# Altium schematic sheet MCU.SchDoc
size A4
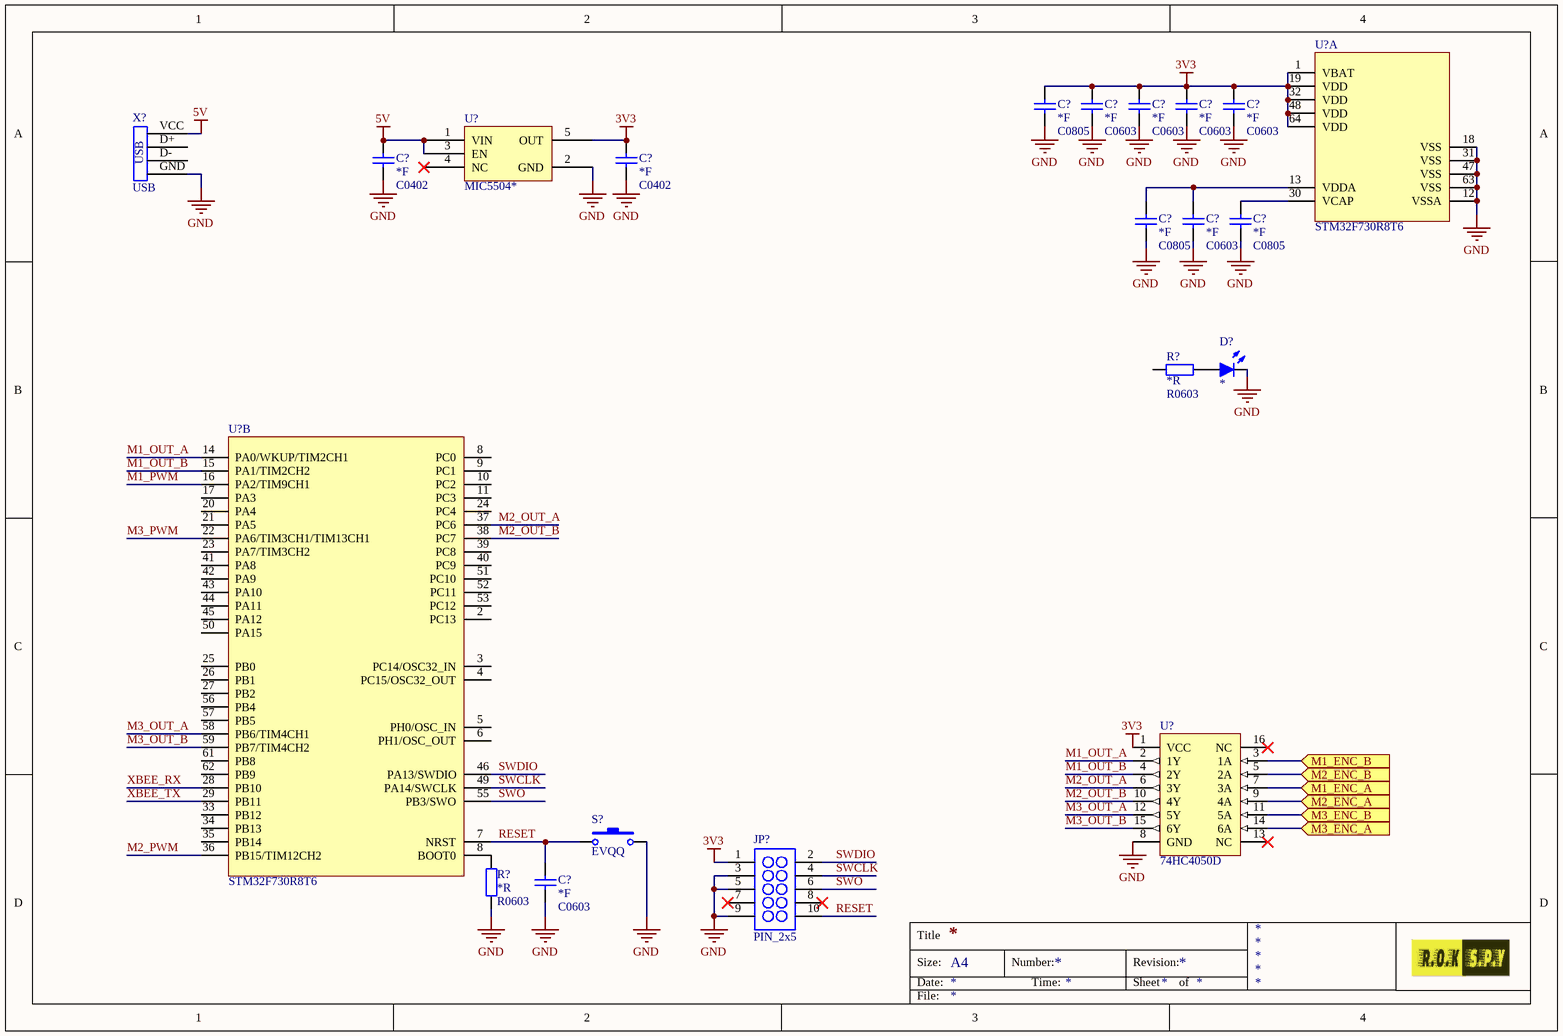
[diagram p0: MCU.SchDoc]

## Parts
(Parts that share a designator on the sheet are numbered #1, #2 ... from top to bottom, then left to right.)
C?#1  Capacitance: *F  [C0805]
C?#2  Capacitance: *F  [C0603]
C?#3  Capacitance: *F  [C0603]
C?#4  Capacitance: *F  [C0603]
C?#5  Capacitance: *F  [C0603]
C?#6  Capacitance: *F  [C0402]
C?#7  Capacitance: *F  [C0402]
C?#8  Capacitance: *F  [C0805]
C?#9  Capacitance: *F  [C0603]
C?#10  Capacitance: *F  [C0805]
C?#11  Capacitance: *F  [C0603]
D?  LED  [LED_0603]  (value not drawn)
JP?  PIN_2x5  [2.54_2X5H]
R?#1  *R  [R0603]
R?#2  *R  [R0603]
S?  EVQQ  [EVQQ]
U?#1  STM32F730R8T6  [QFP50P1200X1200X160-64N]  (part A of 2)
U?#2  MIC5504*  [SOT-235]
U?#3  STM32F730R8T6  [QFP50P1200X1200X160-64N]  (part B of 2)
U?#4  74HC4050D  [SOP127P600X175-16N]
X?  USB  [USB MiniB SMD]

## Ports
M1_ENC_A (in), M1_ENC_B (in), M2_ENC_A (in), M2_ENC_B (in), M3_ENC_A (in), M3_ENC_B (in)

## Nets
3V3: C?#1.2 C?#2.2 C?#3.2 C?#4.2 C?#5.2 C?#7.2 JP?.1 U?#1.1(VBAT) U?#1.19(VDD) U?#1.32(VDD) U?#1.48(VDD) U?#1.64(VDD) U?#2.5(OUT) U?#4.1(VCC)
5V: C?#6.2 U?#2.1(VIN) U?#2.3(EN) X?.VCC
GND: C?#1.1 C?#2.1 C?#3.1 C?#4.1 C?#5.1 C?#6.1 C?#7.1 C?#8.1 C?#9.1 C?#10.1 C?#11.1 D?.2(K) JP?.3 JP?.5 JP?.9 R?#2.1 S?.2 U?#1.12(VSSA) U?#1.18(VSS) U?#1.31(VSS) U?#1.47(VSS) U?#1.63(VSS) U?#2.2(GND) U?#4.8(GND) X?.GND
M1_ENC_A: U?#4.7(3A) ; port M1_ENC_A
M1_ENC_B: U?#4.3(1A) ; port M1_ENC_B
M1_OUT_A: U?#3.14(PA0/WKUP/TIM2CH1) U?#4.2(1Y)
M1_OUT_B: U?#3.15(PA1/TIM2CH2) U?#4.4(2Y)
M1_PWM: U?#3.16(PA2/TIM9CH1)
M2_ENC_A: U?#4.9(4A) ; port M2_ENC_A
M2_ENC_B: U?#4.5(2A) ; port M2_ENC_B
M2_OUT_A: U?#3.37(PC6) U?#4.6(3Y)
M2_OUT_B: U?#3.38(PC7) U?#4.10(4Y)
M2_PWM: U?#3.36(PB15/TIM12CH2)
M3_ENC_A: U?#4.14(6A) ; port M3_ENC_A
M3_ENC_B: U?#4.11(5A) ; port M3_ENC_B
M3_OUT_A: U?#3.58(PB6/TIM4CH1) U?#4.12(5Y)
M3_OUT_B: U?#3.59(PB7/TIM4CH2) U?#4.15(6Y)
M3_PWM: U?#3.22(PA6/TIM3CH1/TIM13CH1)
RESET: C?#11.2 JP?.10 S?.1 U?#3.7(NRST)
SWCLK: JP?.4 U?#3.49(PA14/SWCLK)
SWDIO: JP?.2 U?#3.46(PA13/SWDIO)
SWO: JP?.6 U?#3.55(PB3/SWO)
XBEE_RX: U?#3.28(PB10)
XBEE_TX: U?#3.29(PB11)
NetC?#8_2: C?#8.2 C?#9.2 U?#1.13(VDDA)
NetC?#10_2: C?#10.2 U?#1.30(VCAP)
NetD?_1: D?.1(A) R?#1.1
NetR?#2_2: R?#2.2 U?#3.8(PC0)

Not connected (* = marked no-connect by the designer): JP? 7* 8*; R?#1 2; U?#2 4(NC)*; U?#3 2(PC13) 3(PC14/OSC32_IN) 4(PC15/OSC32_OUT) 5(PH0/OSC_IN) 6(PH1/OSC_OUT) 9(PC1) 10(PC2) 11(PC3) 17(PA3) 20(PA4) 21(PA5) 23(PA7/TIM3CH2) 24(PC4) 25(PB0) 26(PB1) 27(PB2) 33(PB12) 34(PB13) 35(PB14) 39(PC8) 40(PC9) 41(PA8) 42(PA9) 43(PA10) 44(PA11) 45(PA12) 50(PA15) 51(PC10) 52(PC11) 53(PC12) 56(PB4) 57(PB5) 61(PB8) 62(PB9); U?#4 13(NC)* 16(NC)*; X? D+ D-

## Notes on the sheet
- Title
- Size:
- Date:
- A4
- Number:
- Time:
- Revision:
- Sheet
- of
- File:

## Library data of the parts
C?#1-C?#11 = Capacitor: Ceramic capacitor; Type: MLCC; Voltage rating: *V; ComponentLinknDescription: Datasheet; Characteristic: *; Manufacturer: *; ComponentLinknURL: *
  C?#1 C?#8 C?#10: Note: C0805
  C?#2-C?#5 C?#9 C?#11: Note: C0603
  C?#6 C?#7: Note: C0402
D? = LED: Light Emitting Diode; ComponentLinknDescription: Datasheet; Space heritage: false; Current rating: *mA; Power dissipation: false; Colour: *
R?#1 R?#2 = Resistor: Precision: *%; Voltage rating: *V; Temp coefficient: *ppm; Power rating: *mW; ComponentLinknDescription: Datasheet; Manufacturer: *; ComponentLinknURL: *; Resistance: *R; Note: R0603
S? = EVQQ: Switch; Manufacturer: Panasonic; ComponentLinknDescription: Datasheet; Space heritage: false; Drawn by: Erik Ilbis; Verified: false; Part number: EVQQ
U?#1 U?#3 = STM32F730R8T6: STM32F7 Series Microcontroller; Manufacturer: ST; CreatedBy: Roberts Oskars Komarovskis; Farnell order nr: 2980932; Mouser order nr: 511-STM32F730R8T6; PartNumber: STM32F730R8T6; ComponentLink1Description: Datasheet; ComponentLink1URL: https://eu.mouser.com/datasheet/2/389/dm00493485-1799333.pdf
U?#2 = MIC5504: Low-dropout voltage regulator; Manufacturer: Microchip/Micrel; Space heritage: false; Current Rating: 300 mA; Input Voltage: 2V5 to 5V5; Accuracy: 2%; Part number: MIC5504; Verified: false; Drawn by: Roberts Oskars Komarovskis; ComponentLink1Description: Datasheet; ComponentLink1URL: https://www.mouser.ee/datasheet/2/268/MIC550X-1082389.pdf; Package Type: *
U?#4 = 74HC4050D: Logic Level Converter, Maximum output voltage is equal to Vcc; Manufacturer: Nexperia; Supply Voltage: 2 - 6V; Max input voltage: 15V; ComponentLink1Description: Datasheet; ComponentLink1URL: http://www.farnell.com/datasheets/2030251.pdf?_ga=2.69434709.497144466.1600641848-1290644116.1596735146; Drawn By: Roberts Oskars Komarovskis; PartNumber: 74HC4050D; Farnell Order nr.: 1085272
JP? = PIN_2x5: Manufacturer: *; Part Number: *; ComponentLinknDescription: *; ComponentLinknURL: *; Drawn By: Erik Ilbis